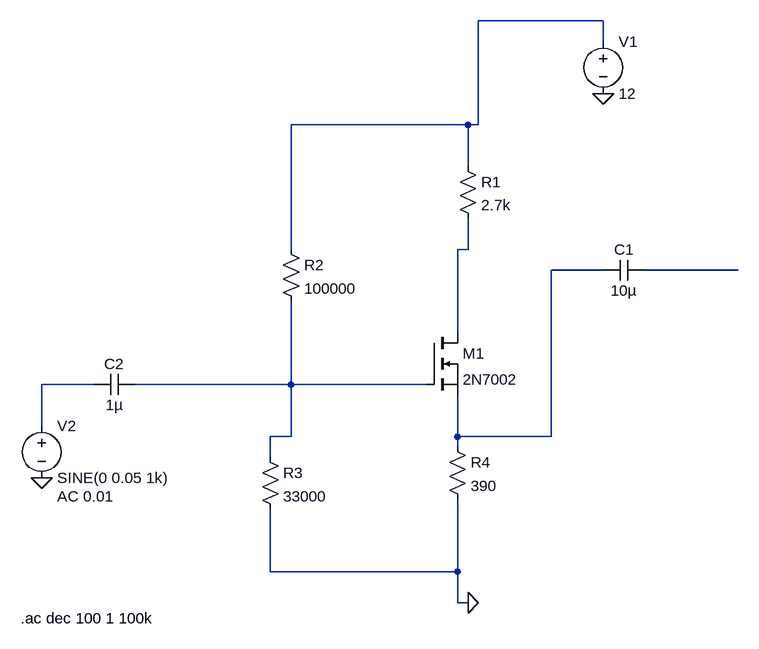
[diagram p0: schematic common drain.asc]
common drain.asc, the LTspice schematic file:
Version 4.1
SHEET 1 880 680
WIRE 544 -336 352 -336
WIRE 544 -304 544 -336
WIRE 336 -176 64 -176
WIRE 352 -176 352 -336
WIRE 352 -176 336 -176
WIRE 336 -112 336 -176
WIRE 64 16 64 -176
WIRE 336 16 336 -32
WIRE 336 16 320 16
WIRE 544 48 464 48
WIRE 752 48 608 48
WIRE 320 144 320 16
WIRE -240 224 -320 224
WIRE 64 224 64 96
WIRE 64 224 -176 224
WIRE 272 224 64 224
WIRE -320 288 -320 224
WIRE 64 304 64 224
WIRE 64 304 32 304
WIRE 320 304 320 240
WIRE 464 304 464 48
WIRE 464 304 320 304
WIRE 320 320 320 304
WIRE 32 336 32 304
WIRE 32 512 32 416
WIRE 320 512 320 400
WIRE 320 512 32 512
WIRE 320 560 320 512
WIRE 336 560 320 560
FLAG 544 -224 0
FLAG -320 368 0
FLAG 336 560 0
SYMBOL nmos 272 144 R0
SYMATTR InstName M1
SYMATTR Value 2N7002
SYMBOL res 320 -128 R0
SYMATTR InstName R1
SYMATTR Value 2.7k
SYMBOL res 48 0 R0
SYMATTR InstName R2
SYMATTR Value 100000
SYMBOL res 16 320 R0
SYMATTR InstName R3
SYMATTR Value 33000
SYMBOL voltage 544 -320 R0
WINDOW 123 0 0 Left 0
WINDOW 39 0 0 Left 0
SYMATTR InstName V1
SYMATTR Value 12
SYMBOL cap 608 32 R90
WINDOW 0 0 32 VBottom 2
WINDOW 3 32 32 VTop 2
SYMATTR InstName C1
SYMATTR Value 10µ
SYMBOL cap -176 208 R90
WINDOW 0 0 32 VBottom 2
WINDOW 3 32 32 VTop 2
SYMATTR InstName C2
SYMATTR Value 1µ
SYMBOL voltage -320 272 R0
WINDOW 123 24 124 Left 2
WINDOW 39 0 0 Left 0
SYMATTR InstName V2
SYMATTR Value SINE(0 0.05 1k)
SYMATTR Value2 AC 0.01
SYMBOL res 304 304 R0
SYMATTR InstName R4
SYMATTR Value 390
TEXT -352 584 Left 2 !.ac dec 100 1 100k

The netlist it stands for:
* common drain.asc
M1 N002 N006 N003 N003 2N7002
R1 N001 N002 2.7k
R2 N001 N006 100000
R3 N006 0 33000
V1 N001 0 12
C1 N004 N003 10µ
C2 N006 N005 1µ
V2 N005 0 SINE(0 0.05 1k) AC 0.01
R4 N003 0 390
.model NMOS NMOS
.model PMOS PMOS
.lib standard.mos
.ac dec 100 1 100k
.backanno
.end